# EAGLE design power_board (EAGLE 7.6.0)
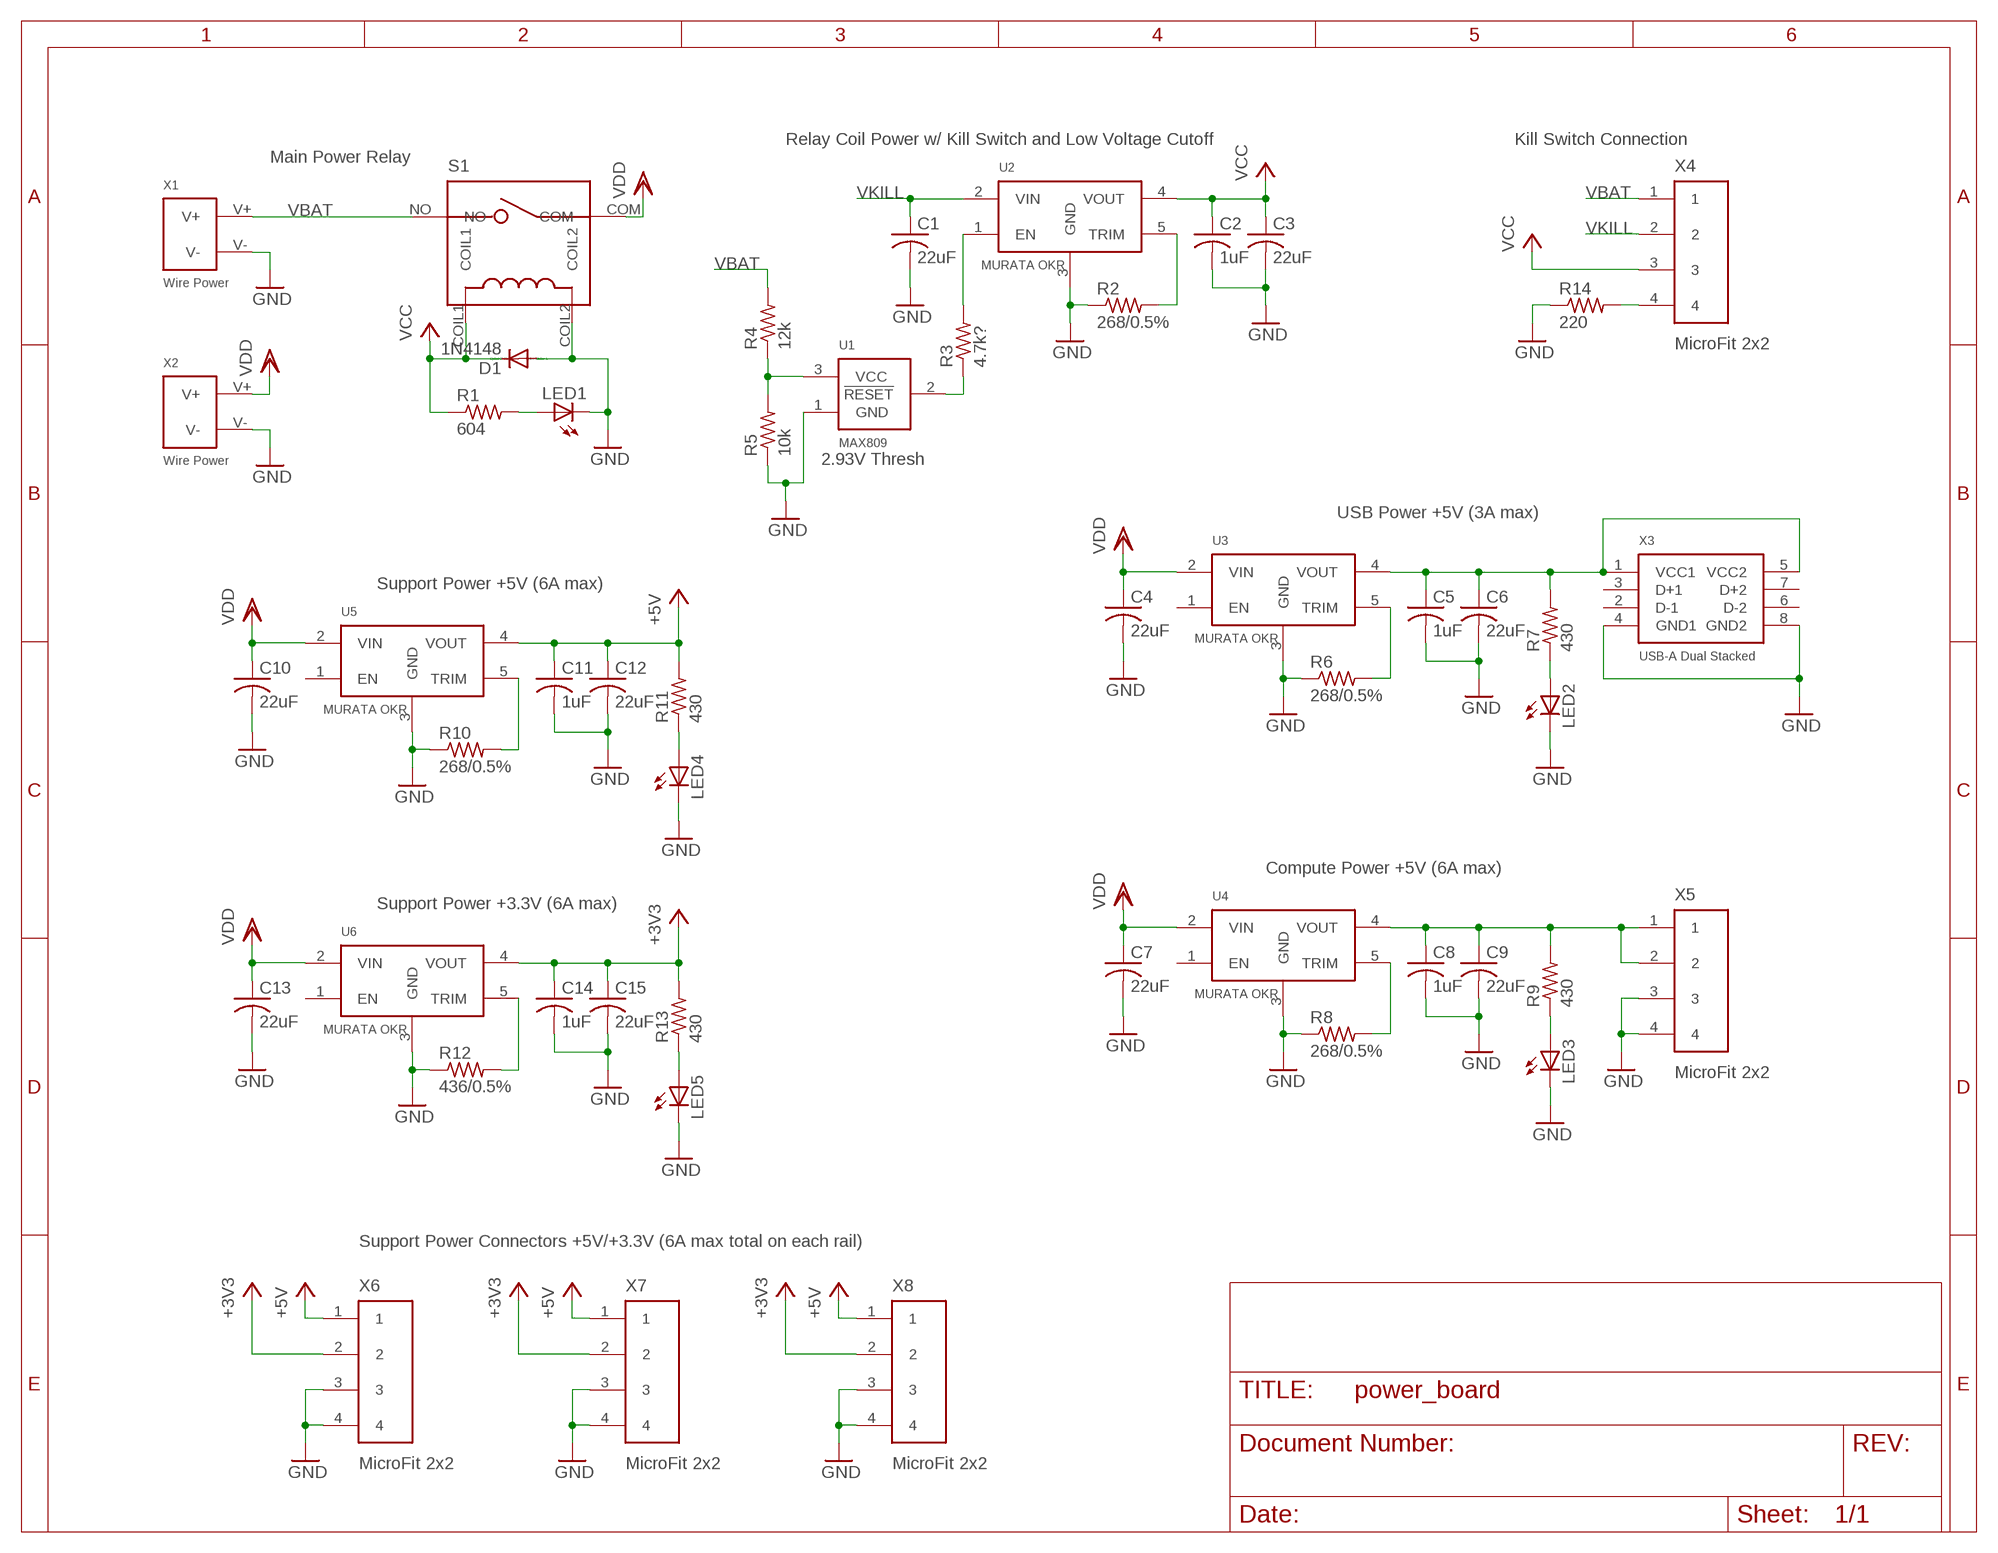
[diagram p0: schematic, sheet 1]

## Parts
C1  22uF  C-USC1210  [C1210]
C2  1uF  C-USC1210  [C1210]
C3  22uF  C-USC1210  [C1210]
C4  22uF  C-USC1210  [C1210]
C5  1uF  C-USC1210  [C1210]
C6  22uF  C-USC1210  [C1210]
C7  22uF  C-USC1210  [C1210]
C8  1uF  C-USC1210  [C1210]
C9  22uF  C-USC1210  [C1210]
C10  22uF  C-USC1210  [C1210]
C11  1uF  C-USC1210  [C1210]
C12  22uF  C-USC1210  [C1210]
C13  22uF  C-USC1210  [C1210]
C14  1uF  C-USC1210  [C1210]
C15  22uF  C-USC1210  [C1210]
D1  1N4148  DIODE-SOD123  [SOD123]
LED1  LEDCHIPLED_0603  [CHIPLED_0603]
LED2  LEDCHIPLED_0603  [CHIPLED_0603]
LED3  LEDCHIPLED_0603  [CHIPLED_0603]
LED4  LEDCHIPLED_0603  [CHIPLED_0603]
LED5  LEDCHIPLED_0603  [CHIPLED_0603]
R1  604  R-US_R0603  [R0603]
R2  268/0.5%  R-US_R0603  [R0603]
R3  4.7k?  R-US_R0603  [R0603]
R4  12k  R-US_R0603  [R0603]
R5  10k  R-US_R0603  [R0603]
R6  268/0.5%  R-US_R0603  [R0603]
R7  430  R-US_R0603  [R0603]
R8  268/0.5%  R-US_R0603  [R0603]
R9  430  R-US_R0603  [R0603]
R10  268/0.5%  R-US_R0603  [R0603]
R11  430  R-US_R0603  [R0603]
R12  436/0.5%  R-US_R0603  [R0603]
R13  430  R-US_R0603  [R0603]
R14  220  R-US_R0603  [R0603]
S1  T90S1D12-5  [T90S1D12-5]
U1  MAX809  [SOT-23]
U2  MURATA-OKR  [MURATA-OKR]
U3  MURATA-OKR  [MURATA-OKR]
U4  MURATA-OKR  [MURATA-OKR]
U5  MURATA-OKR  [MURATA-OKR]
U6  MURATA-OKR  [MURATA-OKR]
X1  WIRE-POWER  [WIRE-POWER]
X2  WIRE-POWER  [WIRE-POWER]
X3  USB-A-STACKED  [USB-A-STACKED]
X4  MICROFIT-2X2-SMD  [MICROFIT-2X2-0430450411]
X5  MICROFIT-2X2-SMD  [MICROFIT-2X2-0430450411]
X6  MICROFIT-2X2-SMD  [MICROFIT-2X2-0430450411]
X7  MICROFIT-2X2-SMD  [MICROFIT-2X2-0430450411]
X8  MICROFIT-2X2-SMD  [MICROFIT-2X2-0430450411]

## Nets
+3V3: C14.1 C15.1 R13.2 U6.4(VOUT) X6.2 X7.2 X8.2
+5V: C11.1 C12.1 R11.2 U5.4(VOUT) X6.1 X7.1 X8.1
GND: C1.2 C2.2 C3.2 C4.2 C5.2 C6.2 C7.2 C8.2 C9.2 C10.2 C11.2 C12.2 C13.2 C14.2 C15.2 D1.A LED1.C LED2.C LED3.C LED4.C LED5.C R2.1 R5.1 R6.1 R8.1 R10.1 R12.1 R14.1 S1.COIL2 U1.1(GND) U2.3(GND) U3.3(GND) U4.3(GND) U5.3(GND) U6.3(GND) X1.V- X2.V- X3.4(GND1) X3.8(GND2) X5.3 X5.4 X6.3 X6.4 X7.3 X7.4 X8.3 X8.4
N$1: LED2.A R7.1
N$2: LED1.A R1.2
N$4: R2.2 U2.5(TRIM)
N$5: R3.1 U1.2(!RESET!)
N$6: R8.2 U4.5(TRIM)
N$7: R6.2 U3.5(TRIM)
N$8: R4.1 R5.2 U1.3(VCC)
N$9: C8.1 C9.1 R9.2 U4.4(VOUT) X5.1 X5.2
N$11: LED3.A R9.1
N$13: LED4.A R11.1
N$14: LED5.A R13.1
N$15: R3.2 U2.1(EN)
N$17: R12.2 U6.5(TRIM)
N$18: R10.2 U5.5(TRIM)
N$19: R14.2 X4.4
USB5V: C5.1 C6.1 R7.2 U3.4(VOUT) X3.1(VCC1) X3.5(VCC2)
VBAT: R4.2 S1.NO X1.V+ X4.1
VCC: C2.1 C3.1 D1.C R1.1 S1.COIL1 U2.4(VOUT) X4.3
VDD: C4.1 C7.1 C10.1 C13.1 S1.COM U3.2(VIN) U4.2(VIN) U5.2(VIN) U6.2(VIN) X2.V+
VKILL: C1.1 U2.2(VIN) X4.2
Unconnected: U3.1(EN) U4.1(EN) U5.1(EN) U6.1(EN) X3.2(D-1) X3.3(D+1) X3.6(D-2) X3.7(D+2)

## Notes on the sheet
- Relay Coil Power w/ Kill Switch and Low Voltage Cutoff | Kill Switch Connection
- Main Power Relay
- 2.93V Thresh
- USB Power +5V (3A max)
- Support Power +5V (6A max)
- Compute Power +5V (6A max)
- Support Power +3.3V (6A max)
- Support Power Connectors +5V/+3.3V (6A max total on each rail)

## Library data of the parts
C1-C15 = resistor:C-US: CAPACITOR, American symbol
D1 = diode:DIODE-: DIODE
LED1-LED5 = led:LED: LED OSRAM: - CHIPLED LG R971, LG N971, LY N971, LG Q971, LY Q971, LO R971, LY R971 LH N974, LH R974 LS Q976, LO Q976, LY Q976 LO Q996 - Hyper CHIPLED LW Q18S LB Q993, LB Q99A, LB R99A - SideLED LS A670, LO A670, LY A670, LG A670, LP A670 LB A673, LV A673, LT A673, LW A673 LH A674 LY A675 LS A676, LA A676, LO A676, LY A676, LW A676 LS A679, LY A679, LG A679 - Hyper Micro SIDELED® LS Y876, LA Y876, LO Y876, LY Y876 LT Y87S - SmartLED LW L88C, LW L88S LB L89C, LB L89S, LG L890 LS L89K, LO L89K, LY L89K LS L896, LA L896, LO L896, LY L896 - TOPLED LS T670, LO T670, LY T670, LG T670, LP T670 LSG T670, LSP T670, LSY T670, LOP T670, LYG T670 LG T671, LOG T671, LSG T671 LB T673, LV T673, LT T673, LW T673 LH T674 LS T676, LA T676, LO T676, LY T676, LB T676, LH T676, LSB T676, LW T676 LB T67C, LV T67C, LT T67C, LS T67K, LO T67K, LY T67K, LW E67C LS E67B, LA E67B, LO E67B, LY E67B, LB E67C, LV E67C, LT E67C LW T67C LS T679, LY T679, LG T679 LS T770, LO T770, LY T770, LG T770, LP T770 LB T773, LV T773, LT T773, LW T773 LH T774 LS E675, LA E675, LY E675, LS T675 LS T776, LA T776, LO T776, LY T776, LB T776 LHGB T686 LT T68C, LB T68C - Hyper Mini TOPLED® LB M676 - Mini TOPLED Santana® LG M470 LS M47K, LO M47K, LY M47K Source: http://www.osram.convergy.de LUXEON: - LUMILED® LXK2-PW12-R00, LXK2-PW12-S00, LXK2-PW14-U00, LXK2-PW14-V00 LXK2-PM12-R00, LXK2-PM12-S00, LXK2-PM14-U00 LXK2-PE12-Q00, LXK2-PE12-R00, LXK2-PE12-S00, LXK2-PE14-T00, LXK2-PE14-U00 LXK2-PB12-K00, LXK2-PB12-L00, LXK2-PB12-M00, LXK2-PB14-N00, LXK2-PB14-P00, LXK2-PB14-Q00 LXK2-PR12-L00, LXK2-PR12-M00, LXK2-PR14-Q00, LXK2-PR14-R00 LXK2-PD12-Q00, LXK2-PD12-R00, LXK2-PD12-S00 LXK2-PH12-R00, LXK2-PH12-S00 LXK2-PL12-P00, LXK2-PL12-Q00, LXK2-PL12-R00 Source: www.luxeon.com KINGBRIGHT: KA-3528ASYC Source: www.kingbright.com
R1-R14 = resistor:R-US_: RESISTOR, American symbol
S1 = rover12:T90S1D12-5
U1 = rover12:MAX809
U2-U6 = rover12:MURATA-OKR
X1 X2 = rover12:WIRE-POWER
X3 = rover12:USB-A-STACKED
X4-X8 = rover12:MICROFIT-2X2-SMD

## Board
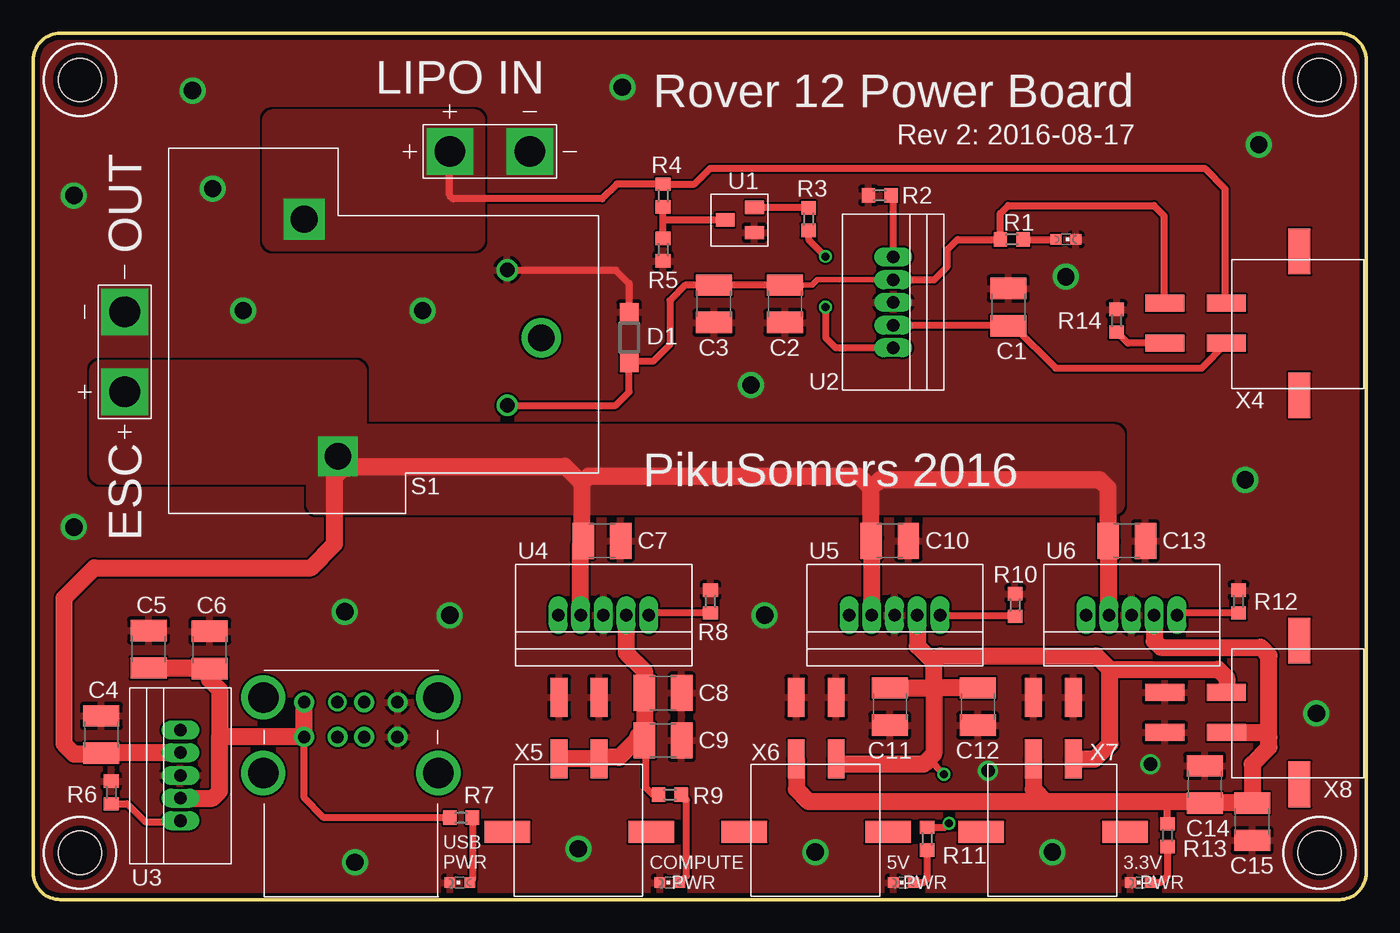
[diagram p1: board, top side]
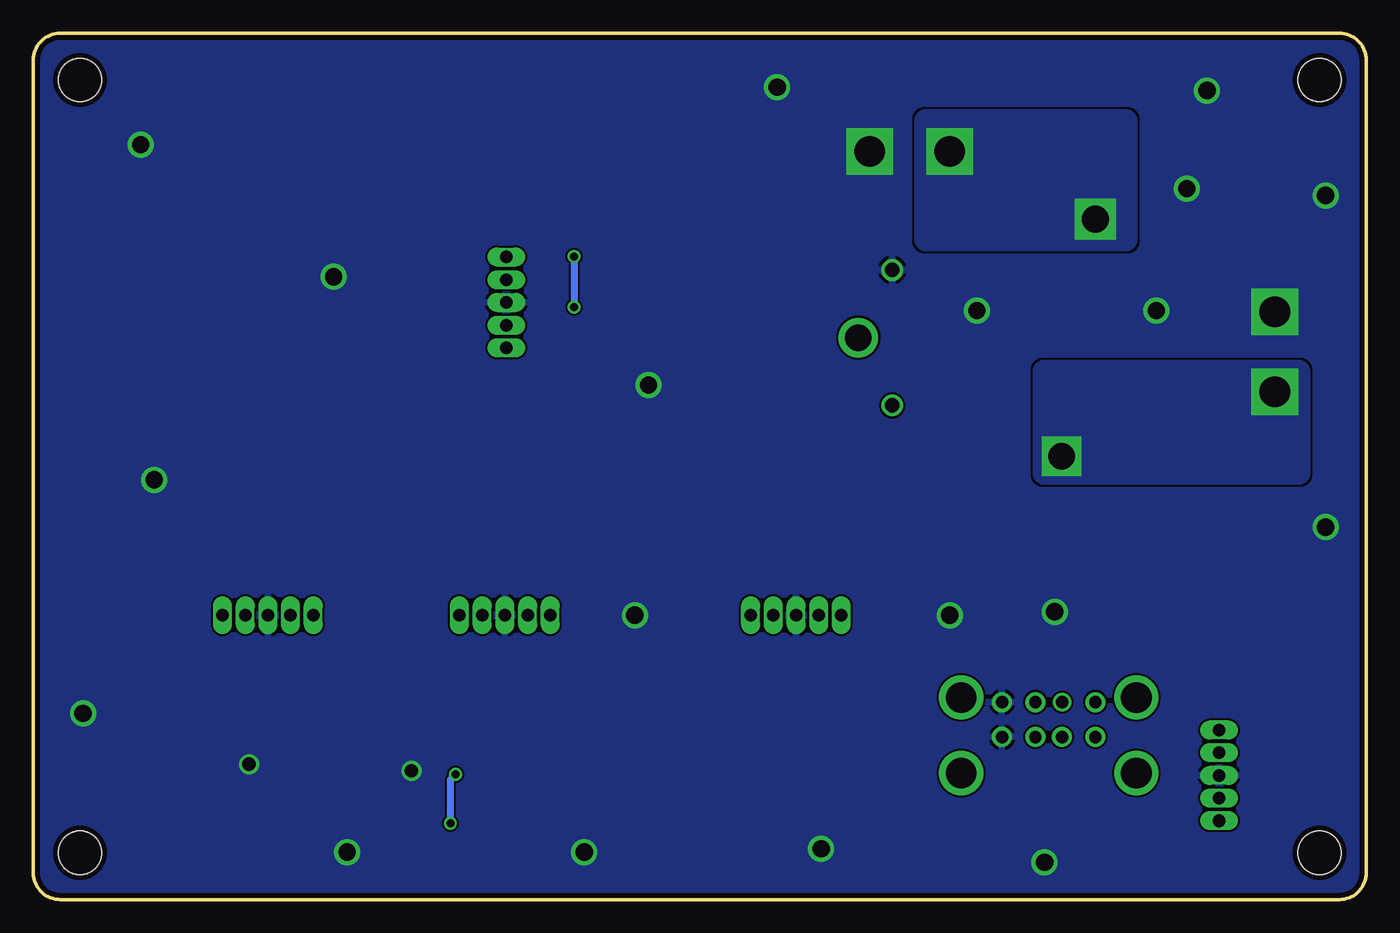
[diagram p2: board, bottom side, seen from below]

Size 100 x 65 mm. Coordinates in mm from the lower left corner, seen from the top.
Outline: 0,2 arc90 2,0 98,0 arc90 100,2 100,63 arc90 98,65 2,65 arc90 0,63 0,2
Copper layers (1*16): Top 0.0356mm / dielectric 1.5011mm / Bottom 0.0356mm
Design rules "oshpark-2layer": minimum track width 6mil, minimum drill 13mil, track to track 6mil, track to pad 6mil, pad to pad 6mil, via to via 6mil, smd to smd 6mil, copper to edge 15mil, drill to drill 6mil, minimum pad ring 7mil, minimum via ring 7mil, stop-mask expansion 2.5mil, vias tented up to drill 0mil, thermal gap 10mil
Holes 3.26 mm at 3.5,3.5 3.5,61.5 96.5,3.5 96.5,61.5

### Footprints (pad centres in the part's own frame; a part is rotated, then mirrored left to right if it is on the bottom)
C1210 = smd 1.6 x 2.7: 1 -1.4,0; 2 1.4,0
SOD123 = smd 1.4 x 1.4: A 1.9,0; C -1.9,0
CHIPLED_0603 = smd 0.8 x 0.8: A 0,-0.75; C 0,0.75
R0603 = smd 1 x 1.1: 1 -0.85,0; 2 0.85,0
T90S1D12-5 = drill 1.092: COIL1 -10.16,0; COIL2 0,0 | drill 1.981 square: COM -13.97,12.7 | drill 1.981: COM2 -5.08,-2.54 | drill 2.057 square: NO 3.81,15.24
SOT-23 = smd 1 x 1.4: 1 0,0; 2 1.9,0; 3 0.95,2.2
MURATA-OKR = drill 0.94 pad 1.27 long: 1 0,0; 2 1.702,0; 3 3.404,0; 4 5.105,0; 5 6.807,0
WIRE-POWER = drill 2.3 pad 3.5 square: V+ 0,0; V- 6,0
USB-A-STACKED = drill 0.92 pad 1.5: 1 0,0; 2 2.5,0; 3 4.5,0; 4 7,0; 5 0,2.62; 7 4.5,2.62; 8 7,2.62 | drill 0.92: 6 2.5,2.62 | drill 2.3: NC1 -3.07,2.97; NC2 10.07,2.97; NC3 -3.07,-2.71; NC4 10.07,-2.71
MICROFIT-2X2-0430450411 = smd 1.27 x 2.921: 1 6.896,5.474; 2 3.899,5.474; 3 6.896,10.097; 4 3.899,10.097 | smd 3.429 x 1.651: NC1 0,0; NC2 10.795,0

### Placement (x,y rotation side)
C1  73.15,44.45 90 top
C2  56.39,44.7 270 top
C3  51.05,44.7 270 top
C4  5.11,12.38 90 top
C5  8.65,18.78 90 top
C6  13.24,18.73 90 top
C7  42.67,26.92 0 top
C8  47.24,15.49 0 top
C9  47.24,11.94 0 top
C10  64.26,26.92 0 top
C11  64.26,14.48 270 top
C12  70.87,14.48 270 top
C13  82.04,26.92 0 top
C14  87.88,8.64 90 top
C15  91.44,5.84 270 top
D1  44.7,42.16 90 top
LED1  77.47,49.53 270 top
LED2  32,1.27 90 top
LED3  47.75,1.27 90 top
LED4  65.28,1.27 90 top
LED5  83.06,1.27 90 top
R1  73.41,49.53 0 top
R2  63.5,52.83 0 top
R3  58.17,51.05 270 top
R4  47.24,52.83 90 top
R5  47.24,48.77 90 top
R6  5.84,8.03 270 top
R7  32.1,6.14 180 top
R8  50.8,22.35 270 top
R9  47.75,7.87 180 top
R10  73.66,22.1 270 top
R11  67.06,4.57 90 top
R12  90.42,22.35 270 top
R13  85.09,4.83 90 top
R14  81.28,43.43 270 top
S1  35.56,47.24 90 top
U1  54.1,50.04 90 top
U2  64.52,41.4 90 top
U3  11.03,12.71 270 top
U4  39.37,21.34 0 top
U5  61.21,21.34 0 top
U6  78.99,21.34 0 top
X1  31.24,56.13 0 top
X2  6.86,38.1 90 top
X3  20.32,12.19 0 top
X4  95,37.85 90 top
X5  35.56,5.08 0 top
X6  53.34,5.08 0 top
X7  71.12,5.08 0 top
X8  95,8.64 90 top

### Tracks (layer width: path | path; a pad name or v marks a point on that pad's centre or on a via)
+3V3
  Top 0.508: R13.2 85.09,7.11 85.34,7.37
  Top 1.27: X7.2 75.02,8.29 75.95,7.37 | 75.95,7.37 85.34,7.37 87.75,7.37 C14.1 C15.1 91.44,10.16 92.71,11.43 92.71,12.19 | X6.2 57.24,8.29 58.17,7.37 75.95,7.37 | 92.71,12.19 92.71,18.29 92.08,18.92 84.58,18.92 84.1,19.41 U6.4 | X8.2 92.37,12.54 92.71,12.19
+5V  (via drill 0.6)
  Top 0.508: R11.2 68.41,5.42 v68.71,5.71 | v68.33,9.4 67.18,10.54
  Top 1.27: X7.1 79.64,10.55 80.77,11.68 80.77,17.27 | 80.77,17.27 88.9,17.27 89.53,16.64 89.53,15.54 X8.1 | 80.77,17.27 79.76,18.29 68.07,18.29 67.56,17.78 | U5.4 66.32,19.02 67.56,17.78 | 67.56,16 67.56,15.75 | 67.56,15.75 67.56,10.92 67.18,10.54 66.8,10.16 60.63,10.16 X6.1 | C11.1 67.44,15.88 67.56,16 | 67.56,16 67.69,15.88 C12.1 67.69,15.88 67.56,15.75 | 67.56,16 67.56,17.78
  Bottom 0.508: v68.71,5.71 68.71,9.02 v68.33,9.4
GND  (via drill 1, 1.3)
  Top 0.508: S1.COIL2 43.69,47.24 44.7,46.23 D1.A
  other vias: 3.05,52.83 15.75,44.2 29.21,44.2 13.46,53.34 91.95,56.64 11.94,60.71 44.2,60.96 90.93,31.5 3.05,27.94 23.37,21.59 31.24,21.34 24.13,2.79 40.89,3.81 58.67,3.56 76.45,3.56 96.27,13.97 71.63,9.65 54.86,21.34 83.82,10.16 77.47,46.74 53.85,38.61
  pour Bottom (rank 2): 2,65 arc90 0,63 0,55 0,2 arc90 2,0 7,0 98,0 arc90 100,2 100,5 100,63 arc90 98,65 92,65
  pour Top (rank 2): 2,65 arc90 0,63 0,2 arc90 2,0 3,0 98,0 arc90 100,2 100,4 100,63 arc90 98,65 93,65
  pour Top (no thermals): 4.57,46.23 4.57,42.16 4.57,41.91 9.14,41.91 9.14,42.16 9.14,46.23
  pour Top (no thermals): 35.05,58.17 35.05,53.85 39.88,53.85 39.88,58.17
  pour Bottom (no thermals): 4.57,46.23 4.57,41.91 9.14,41.91 9.14,46.23
  pour Bottom (no thermals): 35.05,58.17 35.05,53.85 39.88,53.85 39.88,58.17
N$1
  Top 0.508: R7.1 32.95,1.46 LED2.A
N$2
  Top 0.508: R1.2 LED1.A
N$4
  Top 0.508: U2.5 64.52,52.67 R2.2
N$5
  Top 0.508: U1.2 58.17,51.94 R3.1
N$6
  Top 0.508: R8.2 46.27,21.5 U4.5
N$7
  Top 0.508: R6.2 7.04,7.18 8.38,5.84 10.97,5.84 U3.5
N$8
  Top 0.508: R5.2 47.24,50.8 | 47.24,50.8 R4.1 | U1.3 47.43,50.99 47.24,50.8
N$9
  Top 0.508: R9.2 46.48,7.87 45.97,8.38 45.97,12.06 C9.1
  Top 1.27: C9.1 C8.1 45.85,17.14 44.48,18.52 U4.4 | 45.47,12.19 43.94,10.67 42.57,10.67 | X5.1 X5.2
  Top 1.524: C9.1 45.47,12.19 | 42.57,10.67 X5.1
N$11
  Top 0.508: LED3.A 48.51,1.27 49.02,1.78 49.02,7.45 R9.1
N$13
  Top 0.508: R11.1 67.06,1.52 66.8,1.27 LED4.A
N$14
  Top 0.508: R13.1 85.09,1.78 84.58,1.27 LED5.A
N$15  (via drill 0.6)
  Top 0.508: R3.2 58.17,49.53 v59.44,48.26 | v59.44,44.45 59.44,42.16 60.2,41.4 U2.1
  Bottom 0.508: v59.44,48.26 v59.44,44.45
N$17
  Top 0.508: R12.2 85.97,21.5 U6.5
N$18
  Top 0.508: U5.5 73.57,21.34 R10.2
N$19
  Top 0.508: X4.4 82.12,41.74 R14.2
USB5V
  Top 0.508: R7.2 21.8,6.14 20.32,7.62 X3.1
  Top 1.27: C5.1 13.19,17.38 C6.1 13.21,17.3 13.21,16.51 13.97,15.75 13.97,12.19 | 13.97,12.19 X3.1 X3.5 | U3.4 13.45,7.61 13.97,8.13 13.97,12.19
VBAT
  Top 0.508: X1.V+ 31.24,52.83 31.5,52.58 42.67,52.58 43.78,53.68 R4.2 49.62,53.68 50.8,54.86 87.88,54.86 89.41,53.34 89.41,44.86 X4.1
  pour Top (isolate 0.508, no thermals): 17.27,49.53 17.27,58.42 arc-90 18.03,59.18 19.05,59.18 33.02,59.18 arc-90 33.78,58.42 33.78,54.61 33.78,50.29 33.78,49.53 arc-90 33.02,48.77 18.03,48.77 arc-90
  pour Bottom (isolate 0.508, no thermals): 17.27,49.53 17.27,58.42 arc-90 18.03,59.18 19.05,59.18 33.02,59.18 arc-90 33.78,58.42 33.78,54.61 33.78,50.29 33.78,49.53 arc-90 33.02,48.77 18.03,48.77 arc-90
VCC
  Top 0.406: U2.4 58.83,46.51 58.42,46.1 C2.1
  Top 0.508: S1.COIL1 43.69,37.08 44.7,38.1 D1.C 44.83,40.39 46.48,40.39 47.75,41.66 47.75,44.96 48.9,46.1 C3.1 C2.1 | U2.4 67.59,46.51 68.58,47.5 68.58,48.77 69.34,49.53 R1.1 72.56,51.47 73.15,52.07 84.07,52.07 84.84,51.31 84.84,44.81 X4.3
VDD
  Top 1.27: U3.2 5.08,11.01 C4.1 5.05,10.92 3.05,10.92 2.29,11.68 2.29,22.61 4.57,24.89 20.83,24.89 22.61,26.67 22.61,31.75 23.49,32.63 | U6.2 80.7,26.87 | U5.2 62.92,27.12 | C10.1 62.86,30.86 | 62.86,30.86 61.98,31.75 41.66,31.75 41.15,31.24 | C13.1 80.64,30.86 80.01,31.5 63.49,31.5 62.86,30.86 | 23.61,32.51 39.88,32.51 41.15,31.24 | U4.2 41.07,26.72 C7.1 41.15,27.05 41.15,31.24
  Top 1.524: 80.7,26.87 C13.1 | 62.92,27.12 C10.1 | 23.61,32.51 23.49,32.63 S1.COM
  pour Top (isolate 0.508, no thermals): 5.08,40.39 arc90 4.32,39.62 4.32,32 arc90 5.08,31.24 24.13,31.24 arc90 24.89,32 24.89,39.62 arc90 24.13,40.39
  pour Bottom (isolate 0.508, no thermals): 5.08,40.39 arc90 4.32,39.62 4.32,32 arc90 5.08,31.24 24.13,31.24 arc90 24.89,32 24.89,39.62 arc90 24.13,40.39
  pour Top (isolate 0.508): 21.08,35.56 81.03,35.56 arc-90 81.79,34.8 81.79,29.72 arc-90 81.03,28.96 77.72,28.96 22.86,28.96 21.34,28.96 arc-90 20.57,29.72 20.57,34.8 20.57,35.31 arc-90 20.83,35.56
VKILL
  Top 0.508: U2.2 73.1,43.1 C1.1 73.54,43.05 76.71,39.88 87.66,39.88 X4.2

### Text on the board
tPlace: LIPO IN | Rover 12 Power Board | Rev 2: 2016-08-17 | OUT | PikuSomers 2016 | ESC | USB / PWR | COMPUTE / PWR | 5V / PWR | 3.3V / PWR